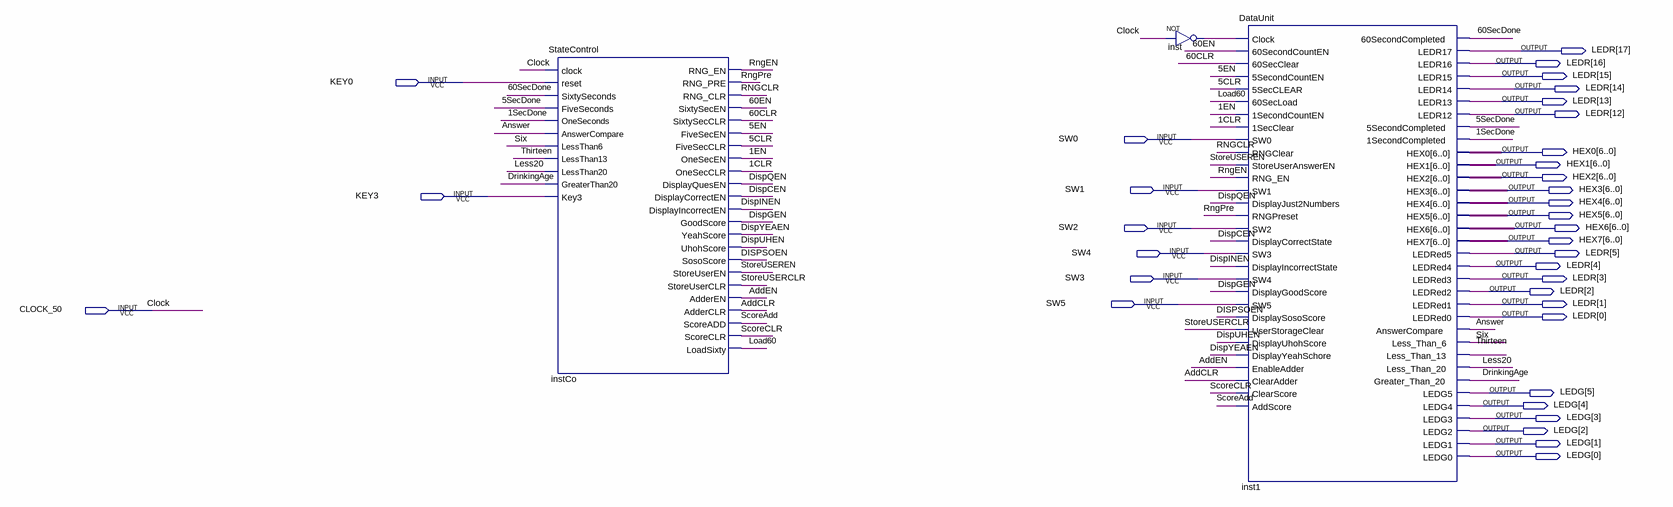
[diagram p0: schematic sheet]
// Quartus schematic MathGameFinalProject.bdf as structural Verilog: 3 symbols, 35 pins
module MathGameFinalProject (
  input  KEY0,
  input  SW0,
  input  SW1,
  input  KEY3,
  input  SW2,
  input  SW4,
  input  SW3,
  input  SW5,
  input  CLOCK_50,
  output [17:0] LEDR,
  output [6:0] HEX0,
  output [6:0] HEX1,
  output [6:0] HEX2,
  output [6:0] HEX3,
  output [6:0] HEX4,
  output [6:0] HEX5,
  output [6:0] HEX6,
  output [6:0] HEX7,
  output [5:0] LEDG
);

  wire \1CLR , \1EN , \1SecDone , \5CLR , \5EN , \5SecDone , \60CLR , \60EN , \60SecDone , AddCLR, AddEN,
       Answer, DispCEN, DispGEN, DispINEN, DispQEN, DISPSOEN, DispUHEN, DispYEAEN, DrinkingAge, inst_out,
       Less20, Load60, RNGCLR, RngEN, RngPre, ScoreAdd, ScoreCLR, Six, StoreUSERCLR, StoreUSEREN, Thirteen;

  StateControl instCo (
    .clock(CLOCK_50), .reset(KEY0), .SixtySeconds(\60SecDone ), .FiveSeconds(\5SecDone ),
    .OneSeconds(\1SecDone ), .AnswerCompare(Answer), .LessThan6(Six), .LessThan13(Thirteen),
    .LessThan20(Less20), .GreaterThan20(DrinkingAge), .Key3(KEY3), .RNG_EN(RngEN), .RNG_PRE(RngPre),
    .RNG_CLR(RNGCLR), .SixtySecEN(\60EN ), .SixtySecCLR(\60CLR ), .FiveSecEN(\5EN ), .FiveSecCLR(\5CLR ),
    .OneSecEN(\1EN ), .OneSecCLR(\1CLR ), .DisplayQuesEN(DispQEN), .DisplayCorrectEN(DispCEN),
    .DisplayIncorrectEN(DispINEN), .GoodScore(DispGEN), .YeahScore(DispYEAEN), .UhohScore(DispUHEN),
    .SosoScore(DISPSOEN), .StoreUserEN(StoreUSEREN), .StoreUserCLR(StoreUSERCLR), .AdderEN(AddEN),
    .AdderCLR(AddCLR), .ScoreADD(ScoreAdd), .ScoreCLR(ScoreCLR), .LoadSixty(Load60));
  not inst (inst_out, CLOCK_50);
  DataUnit inst1 (
    .Clock(inst_out), .\60SecondCountEN (\60EN ), .\60SecClear (\60CLR ), .\5SecondCountEN (\5EN ),
    .\5SecCLEAR (\5CLR ), .\60SecLoad (Load60), .\1SecondCountEN (\1EN ), .\1SecClear (\1CLR ), .SW0(SW0),
    .RNGClear(RNGCLR), .StoreUserAnswerEN(StoreUSEREN), .RNG_EN(RngEN), .SW1(SW1),
    .DisplayJust2Numbers(DispQEN), .RNGPreset(RngPre), .SW2(SW2), .DisplayCorrectState(DispCEN), .SW3(SW4),
    .DisplayIncorrectState(DispINEN), .SW4(SW3), .DisplayGoodScore(DispGEN), .SW5(SW5),
    .DisplaySosoScore(DISPSOEN), .UserStorageClear(StoreUSERCLR), .DisplayUhohScore(DispUHEN),
    .DisplayYeahSchore(DispYEAEN), .EnableAdder(AddEN), .ClearAdder(AddCLR), .ClearScore(ScoreCLR),
    .AddScore(ScoreAdd), .\60SecondCompleted (\60SecDone ), .LEDR17(LEDR[17]), .LEDR16(LEDR[16]),
    .LEDR15(LEDR[15]), .LEDR14(LEDR[14]), .LEDR13(LEDR[13]), .LEDR12(LEDR[12]),
    .\5SecondCompleted (\5SecDone ), .\1SecondCompleted (\1SecDone ), .HEX0(HEX0), .HEX1(HEX1), .HEX2(HEX2),
    .HEX3(HEX3), .HEX4(HEX4), .HEX5(HEX5), .HEX6(HEX6), .HEX7(HEX7), .LEDRed5(LEDR[5]), .LEDRed4(LEDR[4]),
    .LEDRed3(LEDR[3]), .LEDRed2(LEDR[2]), .LEDRed1(LEDR[1]), .LEDRed0(LEDR[0]), .AnswerCompare(Answer),
    .Less_Than_6(Six), .Less_Than_13(Thirteen), .Less_Than_20(Less20), .Greater_Than_20(DrinkingAge),
    .LEDG5(LEDG[5]), .LEDG4(LEDG[4]), .LEDG3(LEDG[3]), .LEDG2(LEDG[2]), .LEDG1(LEDG[1]), .LEDG0(LEDG[0]));

  // Other names for the same wires on the sheet: Clock = CLOCK_50
endmodule
